# Altium schematic sheet Sheet1.SchDoc
size 420 x 297 mm; Address1: Address1; Address2: Address2; Address3: Address3; Address4: Address4; DocumentNumber: АБВГ.123456.001 Э3; SheetNumber: 1; Scale: 1:1; DocumentType: Схема электрическая принципиальная; FirstReferrence: АБВГ.123456.001
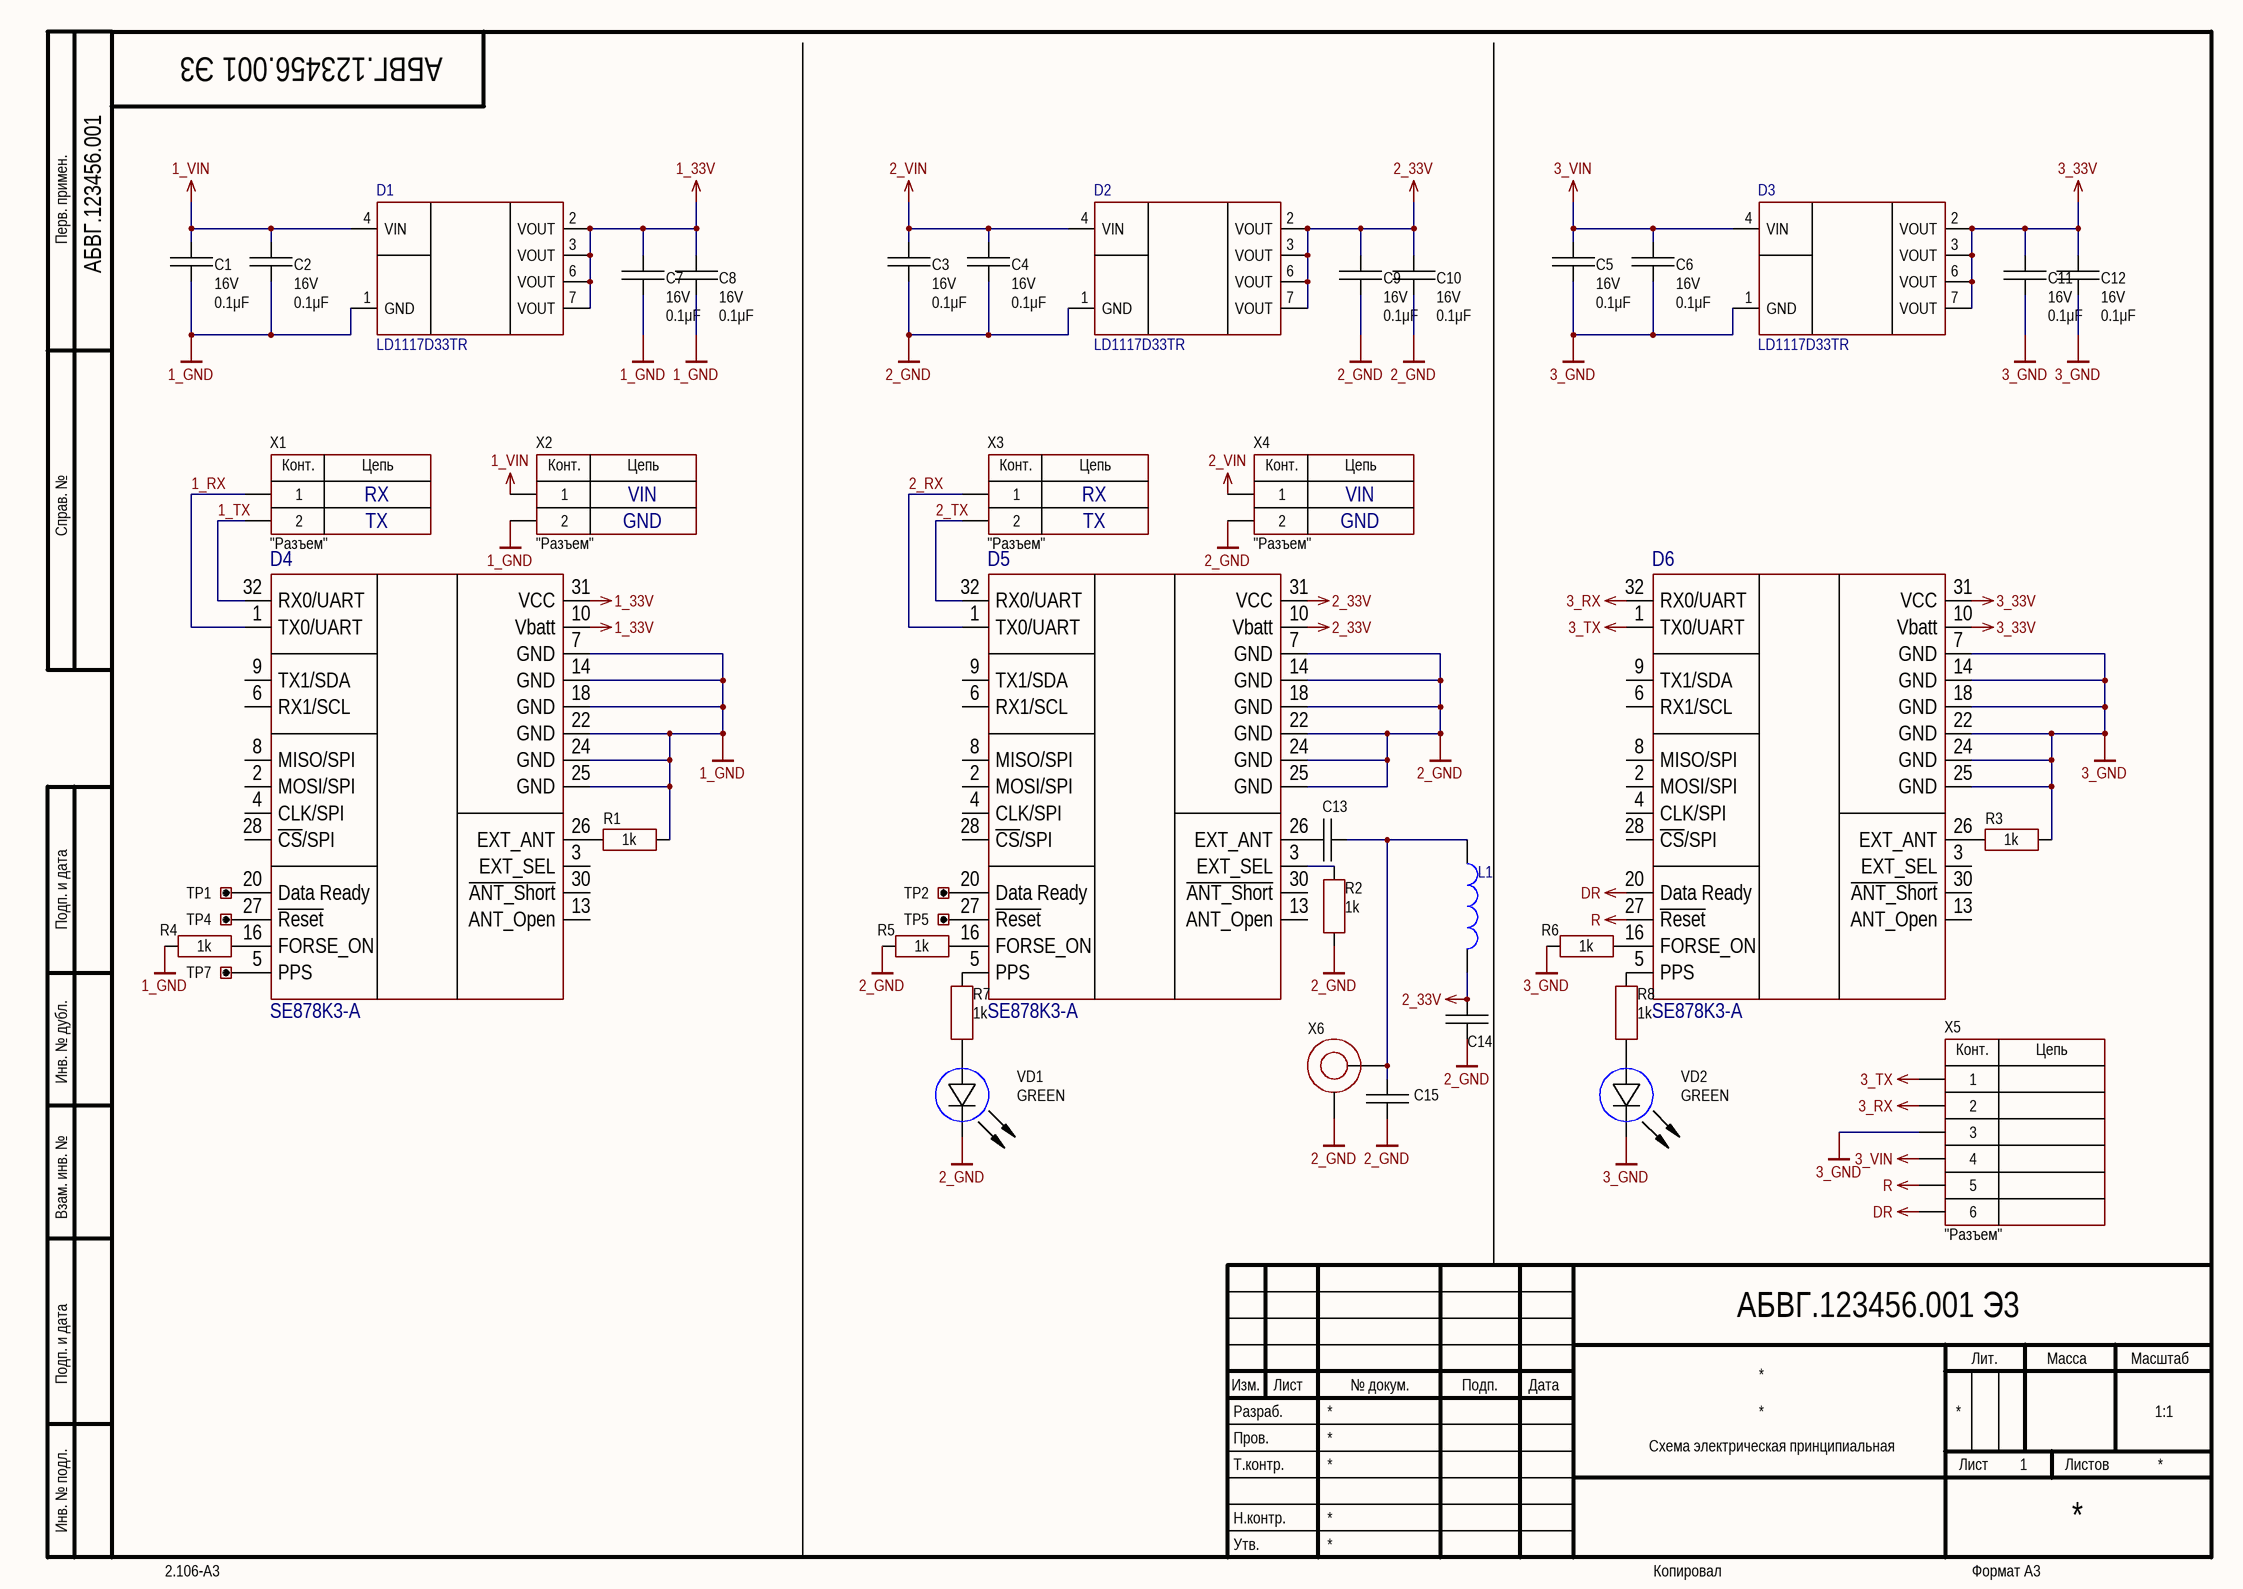
[diagram p0: Sheet1.SchDoc]

## Parts
C1  value 0.1μF  Voltage: 16V  [CAP: 0603]
C2  value 0.1μF  Voltage: 16V  [CAP: 0603]
C3  value 0.1μF  Voltage: 16V  [CAP: 0603]
C4  value 0.1μF  Voltage: 16V  [CAP: 0603]
C5  value 0.1μF  Voltage: 16V  [CAP: 0603]
C6  value 0.1μF  Voltage: 16V  [CAP: 0603]
C7  value 0.1μF  Voltage: 16V  [CAP: 0603]
C8  value 0.1μF  Voltage: 16V  [CAP: 0603]
C9  value 0.1μF  Voltage: 16V  [CAP: 0603]
C10  value 0.1μF  Voltage: 16V  [CAP: 0603]
C11  value 0.1μF  Voltage: 16V  [CAP: 0603]
C12  value 0.1μF  Voltage: 16V  [CAP: 0603]
C13  (no value)  [CAP: 0603]
C14  (no value)  [CAP: 0603]
C15  (no value)  [CAP: 0603]
D1  LD1117D33TR  [8-SOIC]
D2  LD1117D33TR  [8-SOIC]
D3  LD1117D33TR  [8-SOIC]
D4  SE878K3-A  [MOD: SE878K3-A]
D5  SE878K3-A  [MOD: SE878K3-A]
D6  SE878K3-A  [MOD: SE878K3-A]
L1  B09TJL  [IND: BxxT]  (value not drawn)
R1  value 1k  [RES: 0603]
R2  value 1k  [RES: 0603]
R3  value 1k  [RES: 0603]
R4  value 1k  [RES: 0603]
R5  value 1k  [RES: 0603]
R6  value 1k  [RES: 0603]
R7  value 1k  [RES: 0603]
R8  value 1k  [RES: 0603]
TP1  (no value)  [CON: 5000 (Keystone)]
TP2  (no value)  [CON: 5000 (Keystone)]
TP4  (no value)  [CON: 5000 (Keystone)]
TP5  (no value)  [CON: 5000 (Keystone)]
TP7  (no value)  [CON: 5000 (Keystone)]
VD1  Color: GREEN  [LED: 0603G]
VD2  Color: GREEN  [LED: 0603G]
X1  CommentText: "Разъем"  [CON: PLS-2]
X2  CommentText: "Разъем"  [CON: PLS-2]
X3  CommentText: "Разъем"  [CON: PLS-2]
X4  CommentText: "Разъем"  [CON: PLS-2]
X5  CommentText: "Разъем"  [CON: PLS-6]
X6  (no value)  [CON: u.Fl]

## Nets
1_33V: C7.2 C8.2 D1.2(VOUT) D1.3(VOUT) D1.6(VOUT) D1.7(VOUT) D4.10(Vbatt) D4.31(VCC)
1_GND: C1.1 C2.1 C7.1 C8.1 D1.1(GND) D4.7(GND) D4.14(GND) D4.18(GND) D4.22(GND) D4.24(GND) D4.25(GND) R1.2 R4.1 X2.2
1_VIN: C1.2 C2.2 D1.4(VIN) X2.1
2_33V: C9.2 C10.2 C14.2 D2.2(VOUT) D2.3(VOUT) D2.6(VOUT) D2.7(VOUT) D5.10(Vbatt) D5.31(VCC) L1.1
2_GND: C3.1 C4.1 C9.1 C10.1 C14.1 C15.1 D2.1(GND) D5.7(GND) D5.14(GND) D5.18(GND) D5.22(GND) D5.24(GND) D5.25(GND) R2.1 R5.1 VD1.2(C) X4.2 X6.2
2_VIN: C3.2 C4.2 D2.4(VIN) X4.1
3_33V: C11.2 C12.2 D3.2(VOUT) D3.3(VOUT) D3.6(VOUT) D3.7(VOUT) D6.10(Vbatt) D6.31(VCC)
3_GND: C5.1 C6.1 C11.1 C12.1 D3.1(GND) D6.7(GND) D6.14(GND) D6.18(GND) D6.22(GND) D6.24(GND) D6.25(GND) R3.2 R6.1 VD2.2(C) X5.3
3_RX: D6.32(RX0/UART) X5.2
3_TX: D6.1(TX0/UART) X5.1
3_VIN: C5.2 C6.2 D3.4(VIN) X5.4
DR: D6.20(Data_Ready) X5.6
R: D6.27(~{Reset}) X5.5
1_RX: D4.1(TX0/UART) X1.1
1_TX: D4.32(RX0/UART) X1.2
2_RX: D5.1(TX0/UART) X3.1
2_TX: D5.32(RX0/UART) X3.2
NetC13_1: C13.1 C15.2 L1.2 X6.1
NetC13_2: C13.2 D5.26(EXT_ANT)
NetD4_5: D4.5(PPS) TP7.1
NetD4_16: D4.16(FORSE_ON) R4.2
NetD4_20: D4.20(Data_Ready) TP1.1
NetD4_26: D4.26(EXT_ANT) R1.1
NetD4_27: D4.27(~{Reset}) TP4.1
NetD5_3: D5.3(EXT_SEL) R2.2
NetD5_5: D5.5(PPS) R7.2
NetD5_16: D5.16(FORSE_ON) R5.2
NetD5_20: D5.20(Data_Ready) TP2.1
NetD5_27: D5.27(~{Reset}) TP5.1
NetD6_5: D6.5(PPS) R8.2
NetD6_16: D6.16(FORSE_ON) R6.2
NetD6_26: D6.26(EXT_ANT) R3.1
NetR7_1: R7.1 VD1.1(A)
NetR8_1: R8.1 VD2.1(A)

Not connected (* = marked no-connect by the designer): D4 2(MOSI/SPI) 3(EXT_SEL) 4(CLK/SPI) 6(RX1/SCL) 8(MISO/SPI) 9(TX1/SDA) 13(ANT_Open) 28(~{CS}/SPI) 30(~{ANT_Short}); D5 2(MOSI/SPI) 4(CLK/SPI) 6(RX1/SCL) 8(MISO/SPI) 9(TX1/SDA) 13(ANT_Open) 28(~{CS}/SPI) 30(~{ANT_Short}); D6 2(MOSI/SPI) 3(EXT_SEL) 4(CLK/SPI) 6(RX1/SCL) 8(MISO/SPI) 9(TX1/SDA) 13(ANT_Open) 28(~{CS}/SPI) 30(~{ANT_Short})

## Notes on the sheet
- RX
- TX
- VIN
- GND
- Перв. примен.
- Справ. №
- Подп. и дата
- Инв. № дубл.
- Взам. инв. №
- Разраб.
- Изм.
- Лист
- № докум.
- Подп.
- Дата
- Лит.
- Масса
- Масштаб
- Пров.
- Т.контр.
- Листов
- Инв. № подл.
- Утв.
- Н.контр.
- 2.106-A3
- Копировал
- Формат А3
- (in symbol PLS-2) Конт.; Цепь
- (in symbol PLS-6) Конт.; Цепь

## Library data of the parts
C1-C12 = Ceramic_0603: Manufacturer: Yageo; PartNumber: CC0603KRX7R7BB104; ValueManufacturerPartNumber: Ceramic capacitor, 0.1μF, X7R, ±10%, 16V, 0603, -55...+125°C; TypeCapacitor: Ceramic capacitor; Tolerance: ±10%; TypeDielectric: X7R; Package: 0603; HelpURL: https://www.digikey.com/product-detail/en/yageo/CC0603KRX7R7BB104/311-1088-1-ND/302998; Temperature: -55...+125°C
C13 = Ceramic_0603: Manufacturer: Yageo; PartNumber: CC0603KRX7R7BB104; ValueManufacturerPartNumber: Ceramic capacitor, 100Пф, NP0, ±10%, 16V, 0603, -55...+125°C; TypeCapacitor: Ceramic capacitor; Tolerance: ±10%; TypeDielectric: NP0; Voltage: 16V; Value: 100Пф; Package: 0603; HelpURL: https://www.digikey.com/product-detail/en/yageo/CC0603KRX7R7BB104/311-1088-1-ND/302998; Temperature: -55...+125°C
C14 = Ceramic_0603: Manufacturer: Yageo; PartNumber: CC0603KRX7R7BB104; ValueManufacturerPartNumber: Ceramic capacitor, 100 пФ, NP0, ±10%, 16V, 0603, -55...+125°C; TypeCapacitor: Ceramic capacitor; Tolerance: ±10%; TypeDielectric: NP0; Voltage: 16V; Value: 100 пФ; Package: 0603; HelpURL: https://www.digikey.com/product-detail/en/yageo/CC0603KRX7R7BB104/311-1088-1-ND/302998; Temperature: -55...+125°C
C15 = Ceramic_0603: Manufacturer: Yageo; PartNumber: CC0603KRX7R7BB104; ValueManufacturerPartNumber: Ceramic capacitor, 2.2 пФ, NP0, ±10%, 16V, 0603, -55...+125°C; TypeCapacitor: Ceramic capacitor; Tolerance: ±10%; TypeDielectric: NP0; Voltage: 16V; Value: 2.2 пФ; Package: 0603; HelpURL: https://www.digikey.com/product-detail/en/yageo/CC0603KRX7R7BB104/311-1088-1-ND/302998; Temperature: -55...+125°C
D1-D3 = LD1117D33TR: Linear voltage regulator; Manufacturer: ST MICROELECTRONICS; PartNumber: LD1117D33TR; HelpURL: https://eu.mouser.com/datasheet/2/389/ld1117-1849389.pdf; Package: SOIC-8
D4-D6 = SE878K3-A: Smart Antenna GNSS Receiver Module; Manufacturer: TELIT; ValueManufacturerPartNumber: SE878K3-A TELIT; Model: SE878K3-A; Package: QFN-32; HelpURL: https://www.telit.com/m2m-iot-products/positioning-timing-modules/smart-antenna-gnss-se878k3-a/
L1 = Inductor_air: Mini Air Core Inductor; Manufacturer: COILCRAFT; Value: 35 нГн; Tolerance: +-5%; Model: B09TJL; HelpURL: https://www.mouser.pl/ProductDetail/Coilcraft/B09TJLC?qs=zCSbvcPd3pYV%2FA6WdXVVuw%3D%3D
R1-R8 = Resistor_0603: Manufacturer: Yageo; PartNumber: RC0603JR-07100RL; ValueManufacturerPartNumber: Resistor film, 1k, ±5%, 0603, 0.1W, -55...+125°C; TypeResistor: Resistor film; Power: 0.1W; Tolerance: ±5%; Package: 0603; HelpURL: https://www.digikey.com/product-detail/en/yageo/RC0603JR-07100RL/311-100GRCT-ND/729644; Temperature: -55...+125°C
TP1 TP2 TP4 TP5 TP7 = Connector_Test_Point: Manufacturer: Keystone; ValueManufacturerPartNumber: Test point, Keystone, 5001; PartNumber: 5001; TypeConnector: Test point; HelpURL: https://www.digikey.com/product-detail/en/keystone-electronics/5001/36-5001-ND/255327
VD1 VD2 = LED_single: ValueManufacturerPartNumber: LED, Green, *, *, *, -55...+150°C; TypeDiode: LED; Manufacturer: *; Package: *; HelpURL: *; Temperature: -55...+150°C; Current: *; VoltageDrop: *; PartNumber: *; ColorParameter: Green
X1-X4 = PLS-2: Manufacturer: Connfly; ValueManufacturerPartNumber: Connector, 2pin, 2.54mm, 500VAC, 3A; TypeConnector: Connector; VoltageMax: 500VAC; Pitch: 2.54mm; CurrentMax: 3A; Multichannel: 2pin; HelpURL: https://www.chipdip.ru/product/pls-2; PartNumber: PLS-2
X5 = PLS-6: Manufacturer: Connfly; ValueManufacturerPartNumber: Connector, 6pin, 2.54mm, 500VAC, 3A; TypeConnector: Connector; VoltageMax: 500VAC; Pitch: 2.54mm; CurrentMax: 3A; Multichannel: 6pin; HelpURL: https://www.chipdip.ru/product/pls-6; PartNumber: PLS-6
X6 = Connector_uFL: Manufacturer: Hirose Electric; ValueManufacturerPartNumber: Connector u.FL, 50 Ohm, 6GHz; PartNumber: U.FL-R-SMT(01); TypeConnector: Connector u.FL; Frequency: 6GHz; Impedance: 50 Ohm; CommentText: "Разъем"; HelpURL: https://www.digikey.com/product-detail/en/hirose-electric-co-ltd/U.FL-R-SMT-01/H9161-ND/513010